# EAGLE design Codeshelf-0006.v02 (EAGLE 6.5.0)
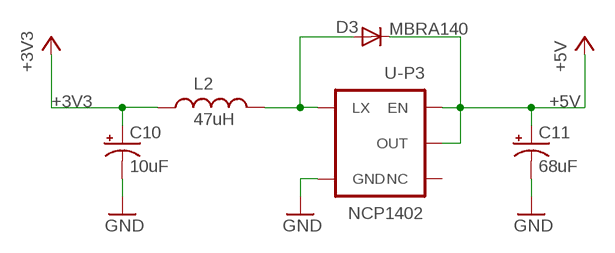
[diagram p0: schematic, sheet 1]

## Parts
C10  10uF  CAP_POL1206  [EIA3216]
C11  68uF  CAP_POL3528  [EIA3528]
D3  MBRA140  DIODESMA  [SMA-DIODE]
L2  47uH  INDUCTORCR54  [CR54]
U-P3  NCP1402  V_REG_NCP1400SOT23-5  [SOT23-5]

## Nets
+3V3 [3v3]: C10.A(+) L2.P$1
+5V [5V]: C11.A(+) D3.C U-P3.1(EN) U-P3.2(OUT)
GND [GND]: C10.C(-) C11.C(-) U-P3.4(GND)
N$5: D3.A L2.P$2 U-P3.5(LX)
Unconnected: U-P3.3(NC)

## Library data of the parts
C10 = SparkFun:CAP_POL: Capacitor Polarized These are standard SMD and PTH capacitors. Normally 10uF, 47uF, and 100uF in electrolytic and tantalum varieties. Always verify the external diameter of the through hole cap, it varies with capacity, voltage, and manufacturer. The EIA devices should be standard.; MFGN: Kemet; MFGP: T491A106K016AT; PRICE: 0.36
C11 = SparkFun:CAP_POL: Capacitor Polarized These are standard SMD and PTH capacitors. Normally 10uF, 47uF, and 100uF in electrolytic and tantalum varieties. Always verify the external diameter of the through hole cap, it varies with capacity, voltage, and manufacturer. The EIA devices should be standard.; MFGN: Vishay; MFGP: TR3B686K010C0600; PRICE: 1.13
D3 = SparkFun:DIODE: Diode These are standard reverse protection diodes and small signal diodes. SMA package can handle up to about 1A. SOD-323 can handle about 200mA. What the SOD-323 package when ordering, there are some mfgs out there that are 5-pin packages.; MFGN: On Semi; MFGP: MBRA140T3G; PRICE: 0.47
L2 = SparkFun:INDUCTOR: Inductors Basic Inductor/Choke - 0603 and 1206. Footprints are not proven and vary greatly between part numbers.; MFGN: Sumida; MFGP: CD54NP-470LC; PRICE: 0.68
U-P3 = SparkFun:V_REG_NCP1400: Switching step-up voltage regulator NCP1400 switiching regulator takes single cell AA and outputs 100mA at 3.3V or 5V with minimal number of external components.; MFGN: On Semi; MFGP: NCP1402SN50T1G; PRICE: 0.63

## Net classes
1 3v3: width 0.6 mm
2 5V: width 0.6 mm
3 +3V3: width 0.6 mm
4 GND: width 0.6 mm
5 RS485: width 0.4 mm

## Board
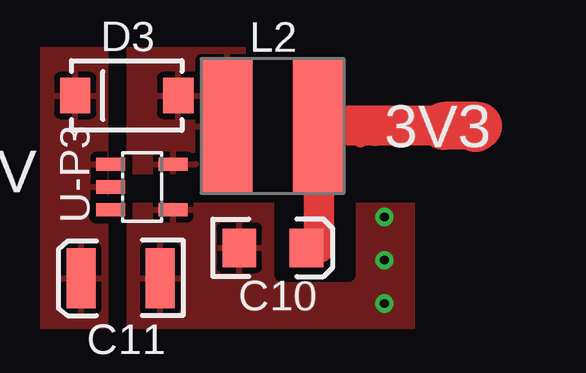
[diagram p1: board, top side]
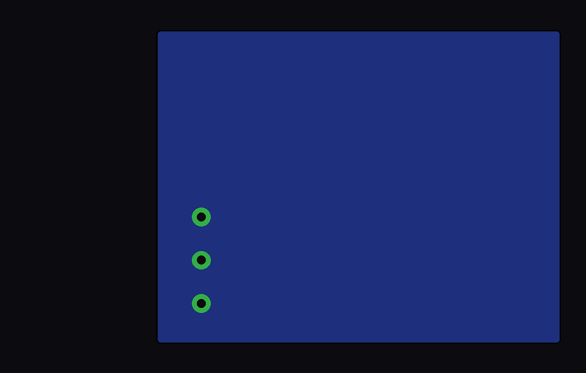
[diagram p2: board, bottom side, seen from below]

No outline drawn. Coordinates in mm, seen from the top.
Copper layers (1*16): Top 0.0356mm / dielectric 1.5011mm / Bottom 0.0356mm
Design rules "SilverCircuits": minimum track width 7mil, minimum drill 14mil, track to track 7mil, track to pad 7mil, pad to pad 7mil, via to via 7mil, smd to smd 0mil, copper to edge 20mil, drill to drill 8mil, minimum pad ring 10mil, minimum via ring 8mil, stop-mask expansion 4mil, vias tented up to drill 0mil, thermal gap 10mil
tRestrict: area 89.6,9.5 to 92.4,19.1; 6 lines

### Footprints (pad centres in the part's own frame; a part is rotated, then mirrored left to right if it is on the bottom)
EIA3216 = smd 1.4 x 1.6: A 1.4,0; C -1.4,0
EIA3528 = smd 1.2 x 2.5: A 1.65,0; C -1.65,0
SMA-DIODE = smd 1.27 x 1.47: A -2.15,0; C 2.15,0
CR54 = smd 5.5 x 2.15: P$1 0,1.92; P$2 0,-1.92
SOT23-5 = smd 0.55 x 1.2: 1 -0.95,-1.3; 2 0,-1.3; 3 0.95,-1.3; 4 0.95,1.3; 5 -0.95,1.3

### Placement (x,y rotation side)
C10  89.25,10.61 0 top
C11  82.9,9.34 180 top
D3  83.15,16.96 180 top
L2  89.25,15.69 270 top
U-P3  83.79,13.15 270 top

### Tracks (layer width: path | path; a pad name or v marks a point on that pad's centre or on a via)
+3V3
  Top 0.406: L2.P$1 93.5,15.69 93.5,15.7
  Top 0.6: 92.9,15.7 92.9,15.1 | 97,16.4 96.83,16.11 96.6,15.7
  Top 1.27: C10.A 91.17,10.61 L2.P$1
  Top 1.676: 91.2,15.7 92.9,15.7 93.5,15.7 96.4,15.7 96.6,15.7
  Top 2: 96.4,15.7 97.8,15.7 97.7,15.6
+5V
  pour Top (isolate 0.305): 79.09,19.5 79.09,6.8 82.27,6.8 82.27,19.5
GND  (via drill 0.36)
  other vias: 93.9,8.3 93.9,10.1 93.9,11.9
  pour Top (isolate 0.305): 83.28,6.8 83.28,12.39 95.35,12.39 95.35,6.8
  pour Bottom (isolate 0.305): 95.6,6.8 79.09,6.8 79.09,19.5 95.6,19.5
N$5
  pour Top (isolate 0.305): 83.28,13.79 83.28,19.5 87.98,19.5 87.98,13.79

### Text on the board
tPlace: +5V | 3V3